# EAGLE design parallel_jtag_programmer_smd (EAGLE 7.6.0)
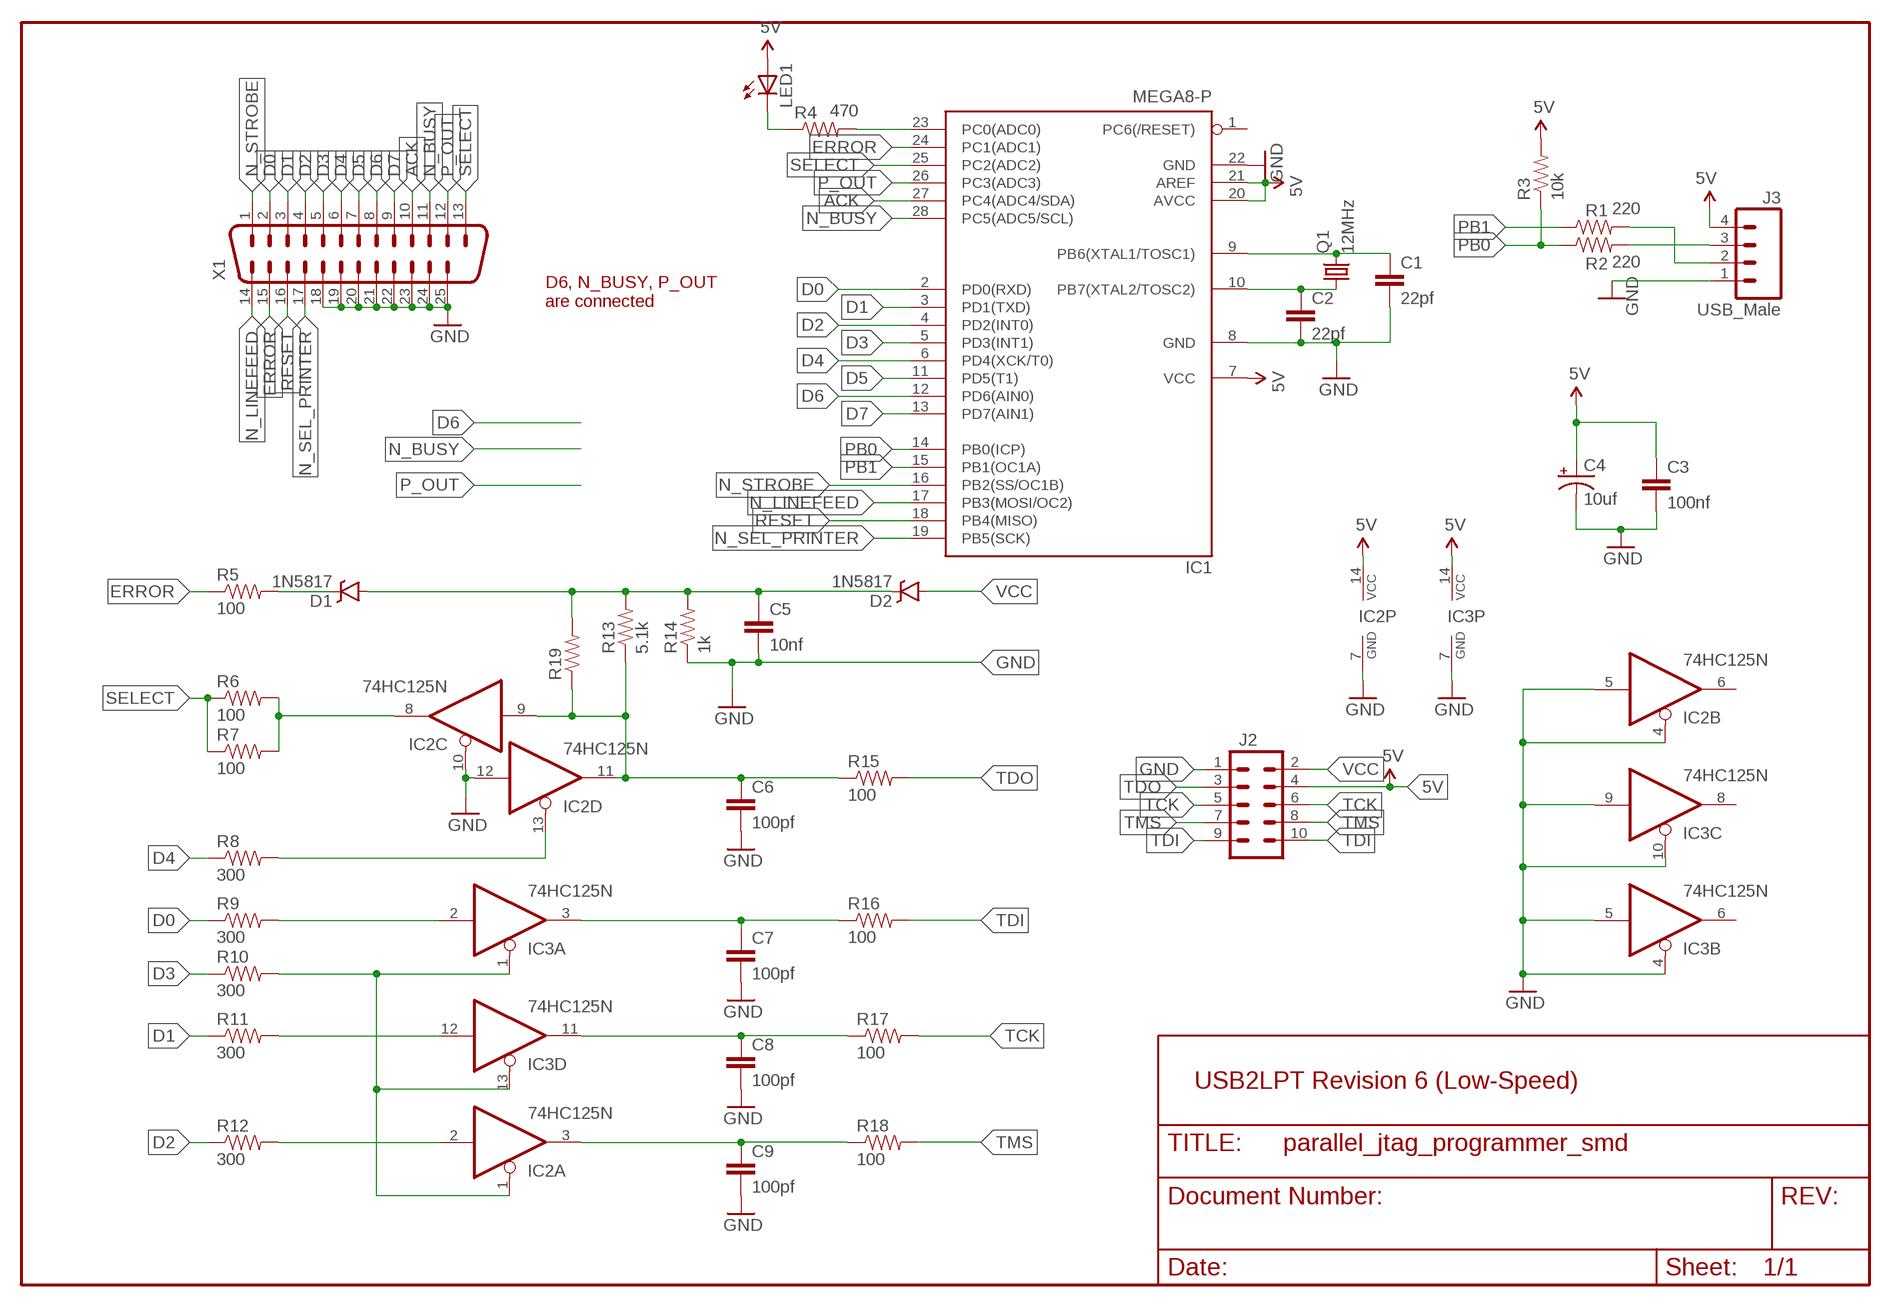
[diagram p0: schematic, sheet 1]

## Parts
C1  22pf  CAPPTH  [CAP-PTH-SMALL]
C2  22pf  CAPPTH  [CAP-PTH-SMALL]
C3  100nf  CAP1206  [1206]
C4  10uf  CAP_POL1206  [EIA3216]
C5  10nf  CAP1206  [1206]
C6  100pf  CAP1206  [1206]
C7  100pf  CAP1206  [1206]
C8  100pf  CAP1206  [1206]
C9  100pf  CAP1206  [1206]
D1  1N5817  DIODE-SCHOTTKY-B340A  [SMA-DIODE]
D2  1N5817  DIODE-SCHOTTKY-B340A  [SMA-DIODE]
IC1  MEGA8-P  [DIL28-3]
IC2  74HC125N  [DIL14]
IC3  74HC125N  [DIL14]
J2  M05X2SHD  [2X5-SHROUDED]
J3  USB_Male  M04PTH  [1X04]
LED1  LED3MM  [LED3MM]
Q1  12MHz  CRYSTALHC49U-V  [HC49U-V]
R1  220  RESISTOR1206  [1206]
R2  220  RESISTOR1206  [1206]
R3  10k  RESISTOR1206  [1206]
R4  470  RESISTOR1206  [1206]
R5  100  RESISTOR1206  [1206]
R6  100  RESISTOR1206  [1206]
R7  100  RESISTOR1206  [1206]
R8  300  RESISTOR1206  [1206]
R9  300  RESISTOR1206  [1206]
R10  300  RESISTOR1206  [1206]
R11  300  RESISTOR1206  [1206]
R12  300  RESISTOR1206  [1206]
R13  5.1k  RESISTOR1206  [1206]
R14  1k  RESISTOR1206  [1206]
R15  100  RESISTOR1206  [1206]
R16  100  RESISTOR1206  [1206]
R17  100  RESISTOR1206  [1206]
R18  100  RESISTOR1206  [1206]
R19  RESISTOR1206  [1206]
X1  DB25D  [M25D]

## Nets
5V: C3.1 C4.A(+) IC1.7(VCC) IC1.20(AVCC) IC1.21(AREF) IC2.14(P:VCC) IC3.14(P:VCC) J2.4 J3.4 LED1.A R3.2
ACK: IC1.27(PC4(ADC4/SDA)) X1.10
D0: IC1.2(PD0(RXD)) R9.1 X1.2
D1: IC1.3(PD1(TXD)) R11.1 X1.3
D2: IC1.4(PD2(INT0)) R12.1 X1.4
D3: IC1.5(PD3(INT1)) R10.1 X1.5
D4: IC1.6(PD4(XCK/T0)) R8.1 X1.6
D5: IC1.11(PD5(T1)) X1.7
D6: IC1.12(PD6(AIN0)) X1.8
D7: IC1.13(PD7(AIN1)) X1.9
ERROR: IC1.24(PC1(ADC1)) R5.1 X1.15
GND: C1.2 C2.2 C3.2 C4.C(-) C5.2 C6.2 C7.2 C8.2 C9.2 IC1.8(GND) IC1.22(GND) IC2.4(B:OE) IC2.5(B:I) IC2.7(P:GND) IC2.10(C:OE) IC2.12(D:I) IC3.4(B:OE) IC3.5(B:I) IC3.7(P:GND) IC3.9(C:I) IC3.10(C:OE) J2.1 J3.1 R14.1 X1.18 X1.19 X1.20 X1.21 X1.22 X1.23 X1.24 X1.25
N$1: LED1.K(C) R4.1
N$2: IC1.23(PC0(ADC0)) R4.2
N$3: C5.1 D1.A D2.C R13.2 R14.2 R19.2
N$4: C2.1 IC1.10(PB7(XTAL2/TOSC2)) Q1.1
N$5: C1.1 IC1.9(PB6(XTAL1/TOSC1)) Q1.2
N$7: J3.3 R2.2
N$9: C6.1 IC2.9(C:I) IC2.11(D:O) R13.1 R15.1 R19.1
N$10: IC2.13(D:OE) R8.2
N$11: IC2.8(C:O) R6.2 R7.2
N$12: J3.2 R1.2
N$13: IC3.2(A:I) R9.2
N$14: IC2.1(A:OE) IC3.1(A:OE) IC3.13(D:OE) R10.2
N$15: D1.C R5.2
N$16: C7.1 IC3.3(A:O) R16.1
N$18: C8.1 IC3.11(D:O) R17.1
N$19: IC3.12(D:I) R11.2
N$20: IC2.2(A:I) R12.2
N$23: C9.1 IC2.3(A:O) R18.1
N_BUSY: IC1.28(PC5(ADC5/SCL)) X1.11
N_LINEFEED: IC1.17(PB3(MOSI/OC2)) X1.14
N_SEL_PRINTER: IC1.19(PB5(SCK)) X1.17
N_STROBE: IC1.16(PB2(SS/OC1B)) X1.1
P_OUT: IC1.26(PC3(ADC3)) X1.12
PB0: IC1.14(PB0(ICP)) R2.1 R3.1
PB1: IC1.15(PB1(OC1A)) R1.1
RESET: IC1.18(PB4(MISO)) X1.16
SELECT: IC1.25(PC2(ADC2)) R6.1 R7.1 X1.13
TCK: J2.5 J2.6 R17.2
TDI: J2.9 J2.10 R16.2
TDO: J2.3 R15.2
TMS: J2.7 J2.8 R18.2
VCC: D2.A J2.2
Unconnected: IC1.1(PC6(/RESET)) IC2.6(B:O) IC3.6(B:O) IC3.8(C:O)

## Notes on the sheet
- D6, N_BUSY, P_OUT
  are connected
- USB2LPT Revision 6 (Low-Speed)

## Library data of the parts
C1-C3 C5-C9 = SparkFun-Passives:CAP: Capacitor Standard 0603 ceramic capacitor, and 0.1" leaded capacitor.
C4 = SparkFun-Passives1:CAP_POL: Capacitor Polarized These are standard SMD and PTH capacitors. Normally 10uF, 47uF, and 100uF in electrolytic and tantalum varieties. Always verify the external diameter of the through hole cap, it varies with capacity, voltage, and manufacturer. The EIA devices should be standard.
D1 D2 = SparkFun-DiscreteSemi:DIODE-SCHOTTKY: Schottky diodes in SFE's production catalog BAT20J 1A 23V 0.62Vf RB751 120mA 40V 0.37Vf PMEG4005EJ 0.5A 40V 0.42Vf MBRA140 1A 40V 0.5Vf B340A 3A 40V SMA; PROD_ID: DIO-09886; VALUE: B340A
IC1 = atmel:MEGA8-P: MICROCONTROLLER 8 Kbytes FLASH, 1 kbytes SRAM, 512 bytes EEPROM, USART, 4-channel 10 bit ADC, 2-channel 8 bit ADC Pin compatible with Atmega48, ATMega88, ATMega168 Source: avr.lbr; OC_FARNELL: unknown; OC_NEWARK: unknown
IC2 IC3 = 74xx-eu:74*125: Quad bus BUFFER, 3-state
J2 = SparkFun-Connectors:M05X2: Header 5x2 Standard 10-pin dual row 0.1" header. Commonly used with AVR-ISP. Use with Spark Fun Electronics SKU: PRT-00778
J3 = SparkFun-Connectors:M04: Header 4 Standard 4-pin 0.1" header. Use with straight break away headers (SKU : PRT-00116), right angle break away headers (PRT-00553), swiss pins (PRT-00743), machine pins (PRT-00117), and female headers (PRT-00115). Molex polarized connector foot print use with SKU : PRT-08231 with associated crimp pins and housings. 1MM SMD Version SKU: PRT-10208; PROD_ID: CONN-09696
LED1 = adafruit:LED: LED OSRAM: - CHIPLED LG R971, LG N971, LY N971, LG Q971, LY Q971, LO R971, LY R971 LH N974, LH R974 LS Q976, LO Q976, LY Q976 LO Q996 - Hyper CHIPLED LW Q18S LB Q993, LB Q99A, LB R99A - SideLED LS A670, LO A670, LY A670, LG A670, LP A670 LB A673, LV A673, LT A673, LW A673 LH A674 LY A675 LS A676, LA A676, LO A676, LY A676, LW A676 LS A679, LY A679, LG A679 - Hyper Micro SIDELED® LS Y876, LA Y876, LO Y876, LY Y876 LT Y87S - SmartLED LW L88C, LW L88S LB L89C, LB L89S, LG L890 LS L89K, LO L89K, LY L89K LS L896, LA L896, LO L896, LY L896 - TOPLED LS T670, LO T670, LY T670, LG T670, LP T670 LSG T670, LSP T670, LSY T670, LOP T670, LYG T670 LG T671, LOG T671, LSG T671 LB T673, LV T673, LT T673, LW T673 LH T674 LS T676, LA T676, LO T676, LY T676, LB T676, LH T676, LSB T676, LW T676 LB T67C, LV T67C, LT T67C, LS T67K, LO T67K, LY T67K, LW E67C LS E67B, LA E67B, LO E67B, LY E67B, LB E67C, LV E67C, LT E67C LW T67C LS T679, LY T679, LG T679 LS T770, LO T770, LY T770, LG T770, LP T770 LB T773, LV T773, LT T773, LW T773 LH T774 LS E675, LA E675, LY E675, LS T675 LS T776, LA T776, LO T776, LY T776, LB T776 LHGB T686 LT T68C, LB T68C - Hyper Mini TOPLED® LB M676 - Mini TOPLED Santana® LG M470 LS M47K, LO M47K, LY M47K Source: http://www.osram.convergy.de/
Q1 = crystal:CRYSTAL: CRYSTAL; OC_FARNELL: 1666969; OC_NEWARK: unknown
R1-R19 = SparkFun-Passives:RESISTOR: Resistor Basic schematic elements and footprints for 0603, 1206, and PTH resistors.
X1 = SparkFun-Connectors:DB25: Various DB25 connectors

## Net classes
0 default: width 0.4 mm, drill 0.8 mm, clearance 0.5 mm

## Board
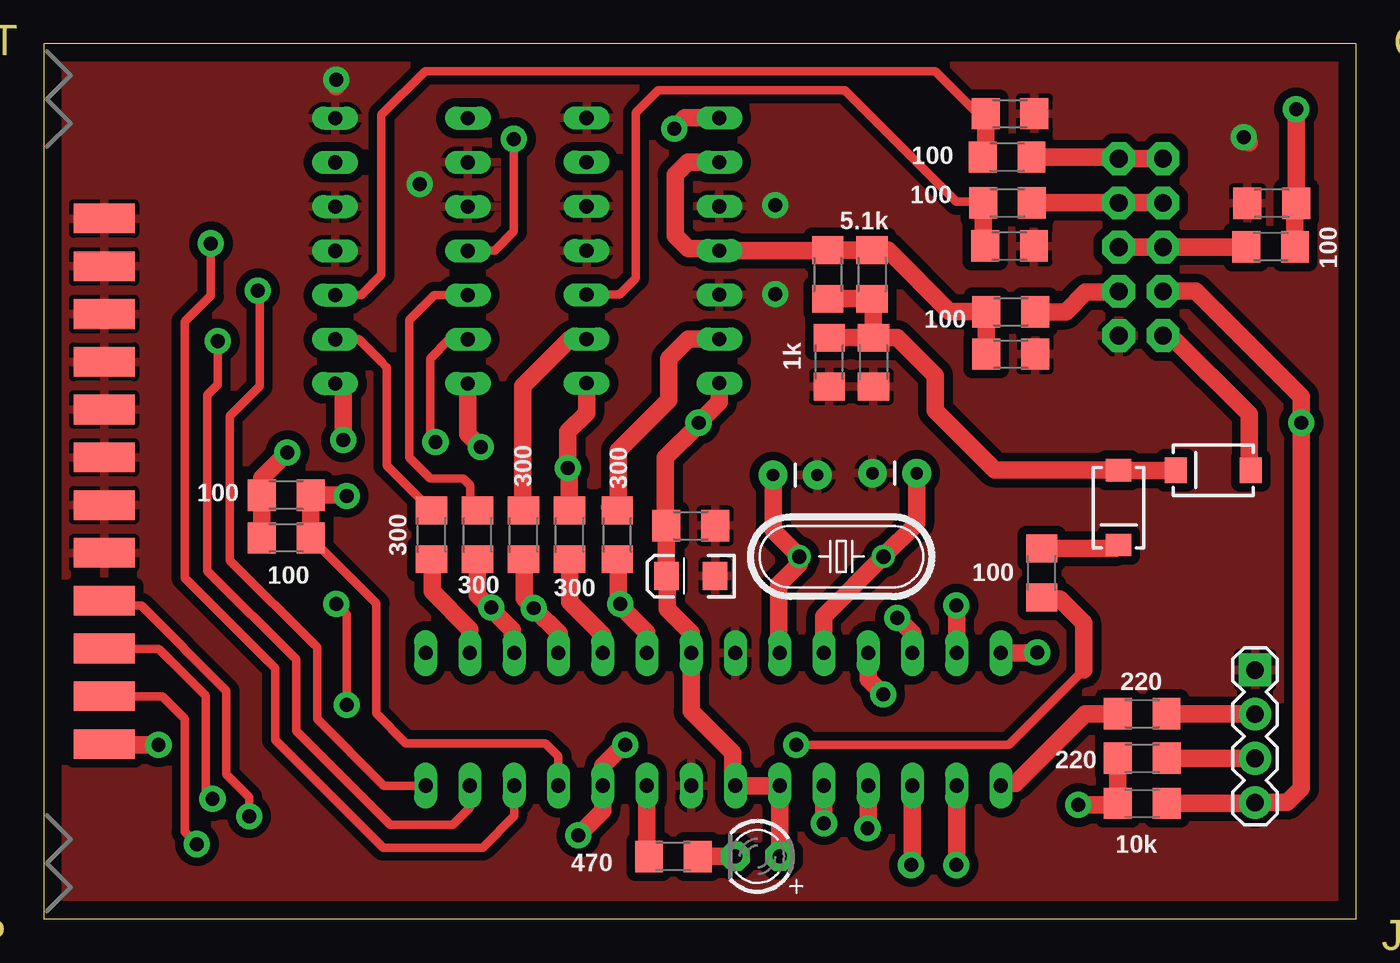
[diagram p1: board, top side]
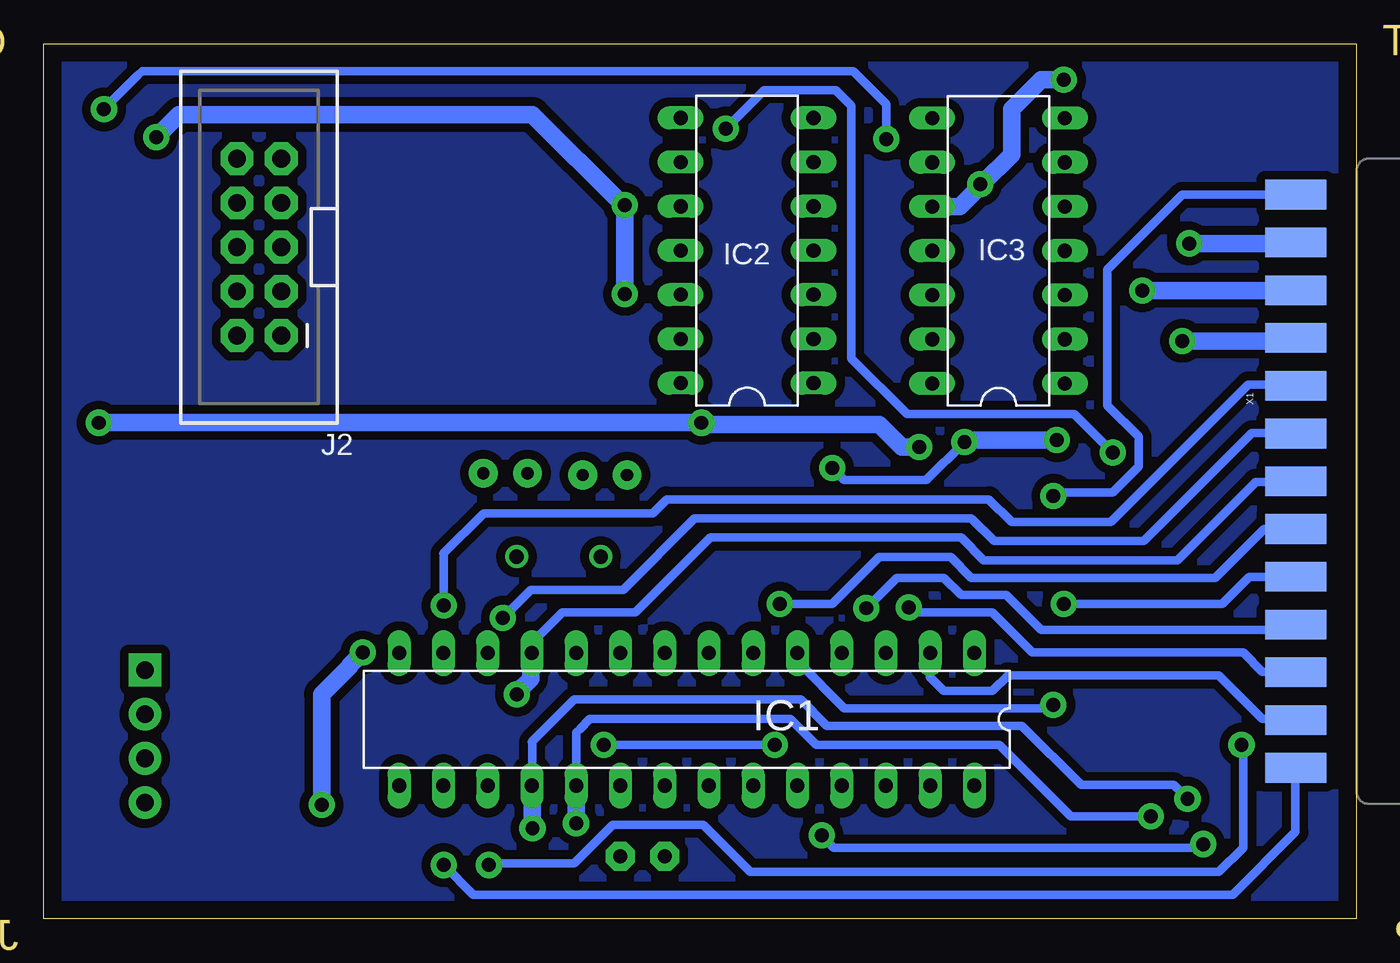
[diagram p2: board, bottom side, seen from below]

Size 75.37 x 50.28 mm. Coordinates in mm from the lower left corner, seen from the top.
Outline: 0,0 75.37,0 75.37,50.28 0,50.28 0,0
Copper layers (1*16): Top 0.035mm / dielectric 1.5mm / Bottom 0.035mm
Design rules "default": minimum track width 10mil, minimum drill 24mil, track to track 8mil, track to pad 8mil, pad to pad 8mil, via to via 8mil, smd to smd 8mil, copper to edge 40mil, drill to drill 8mil, minimum pad ring 10mil, minimum via ring 8mil, stop-mask expansion 4mil, vias tented up to drill 0mil, thermal gap 10mil

### Footprints (pad centres in the part's own frame; a part is rotated, then mirrored left to right if it is on the bottom)
CAP-PTH-SMALL = drill 0.7 pad 1.651: 1 0,0; 2 2.54,0
1206 = smd 1.6 x 1.8: 1 -1.4,0; 2 1.4,0
EIA3216 = smd 1.4 x 1.6: A 1.4,0; C -1.4,0
SMA-DIODE = smd 1.27 x 1.47: A -2.15,0; C 2.15,0
DIL28-3 = drill 0.813 long: 1 -16.51,-3.81; 2 -13.97,-3.81; 3 -11.43,-3.81; 4 -8.89,-3.81; 5 -6.35,-3.81; 6 -3.81,-3.81; 7 -1.27,-3.81; 8 1.27,-3.81; 9 3.81,-3.81; 10 6.35,-3.81; 11 8.89,-3.81; 12 11.43,-3.81; 13 13.97,-3.81; 14 16.51,-3.81; 15 16.51,3.81; 16 13.97,3.81; 17 11.43,3.81; 18 8.89,3.81; 19 6.35,3.81; 20 3.81,3.81; 21 1.27,3.81; 22 -1.27,3.81; 23 -3.81,3.81; 24 -6.35,3.81; 25 -8.89,3.81; 26 -11.43,3.81; 27 -13.97,3.81; 28 -16.51,3.81
DIL14 = drill 0.813 long: 1 -7.62,-3.81; 2 -5.08,-3.81; 3 -2.54,-3.81; 4 0,-3.81; 5 2.54,-3.81; 6 5.08,-3.81; 7 7.62,-3.81; 8 7.62,3.81; 9 5.08,3.81; 10 2.54,3.81; 11 0,3.81; 12 -2.54,3.81; 13 -5.08,3.81; 14 -7.62,3.81
2X5-SHROUDED = drill 1.016 pad 1.88 octagon: 1 -1.27,5.08; 2 1.27,5.08; 3 -1.27,2.54; 4 1.27,2.54; 5 -1.27,0; 6 1.27,0; 7 -1.27,-2.54; 8 1.27,-2.54; 9 -1.27,-5.08; 10 1.27,-5.08
1X04 = drill 1.016 pad 1.88 square: 1 0,0 | drill 1.016 pad 1.88: 2 2.54,0; 3 5.08,0; 4 7.62,0
LED3MM = drill 0.813 pad 1.676 octagon: A -1.27,0; K 1.27,0
HC49U-V = drill 0.813: 1 -2.413,0; 2 2.413,0
M25D = smd 1.7 x 3.5: 1 16.459,-6.045; 2 13.716,-6.045; 3 10.973,-6.045; 4 8.23,-6.045; 5 5.486,-6.045; 6 2.743,-6.045; 7 0,-6.045; 8 -2.743,-6.045; 9 -5.486,-6.045; 10 -8.23,-6.045; 11 -10.973,-6.045; 12 -13.716,-6.045; 13 -16.459,-6.045 | smd 1.7 x 3.5 bottom: 14 15.088,-6.045; 15 12.344,-6.045; 16 9.601,-6.045; 17 6.858,-6.045; 18 4.115,-6.045; 19 1.372,-6.045; 20 -1.372,-6.045; 21 -4.115,-6.045; 22 -6.858,-6.045; 23 -9.601,-6.045; 24 -12.344,-6.045; 25 -15.088,-6.045

### Placement (x,y rotation side)
C1  41.88,25.5 0 top
C2  50.12,25.6 180 top
C3  37.15,22.59 0 top
C4  37.15,19.69 180 top
C5  47.64,31.98 270 top
C6  55.52,32.44 0 top
C7  55.48,46.25 0 top
C8  70.51,41.1 180 top
C9  55.45,38.66 0 top
D1  61.72,23.62 270 top
D2  67.14,25.78 180 top
IC1  38.45,11.47 180 bottom
IC2  34.98,38.39 90 bottom
IC3  20.55,38.38 90 bottom
J2  63,38.59 180 bottom
J3  69.55,14.3 270 top
LED1  40.99,3.59 180 top
Q1  45.8,20.81 180 top
R1  63.06,11.79 0 top
R2  63.07,9.23 0 top
R3  63.07,6.64 0 top
R4  36.16,3.59 180 top
R5  57.3,19.87 90 top
R6  13.93,24.35 180 top
R7  13.93,21.88 180 top
R8  32.94,22.07 90 top
R9  22.28,22.07 90 top
R10  30.2,22.07 90 top
R11  24.92,22.07 90 top
R12  27.56,22.07 90 top
R13  47.56,37.02 270 top
R14  45.11,31.98 90 top
R15  55.52,34.87 0 top
R16  55.31,43.76 0 top
R17  70.44,38.61 180 top
R18  55.34,41.13 0 top
R19  45.02,37.02 270 top
X1  -2.56,25.14 270 bottom

### Tracks (layer width: path | path; a pad name or v marks a point on that pad's centre or on a via)
5V  (via drill 0.8 pad 1.5)
  Top 1: LED1.A IC1.20 IC1.21 39.55,7.82 39.55,9.55 37.18,11.92 IC1.7 37.18,16.42 35.8,17.8 35.8,19.65 C4.A C3.1 35.7,22.64 35.7,26.5 37.6,28.4 v37.6,28.5 38.79,29.69 IC2.14 | IC3.14 24.36,27.84 v25.1,27.1 | R3.2 69.51,6.64 J3.4 69.57,6.7 71.4,6.7 72.2,7.5 v72.2,28.5 72.2,28.6 72.2,30 66.15,36.05 J2.4
  Bottom 1: v37.6,28.5 v72.2,28.5 | v25.1,27.1 26.1,27.1 27.4,28.4 37.5,28.4 v37.6,28.5 | 37.5,28.6 v37.6,28.5
ACK  (via drill 0.8 pad 1.5)
  Top 0.5: IC1.27 24.48,6.38 23.5,5.4 19.9,5.4 14.5,10.8 14.5,14.9 9.4,20 9.4,30.1 10,30.7 v10,33.2
  Bottom 0.5: 3.65,33.2 X1.10
  Bottom 1: 3.65,33.2 v10,33.2
D0
  Top 1: IC1.2 24.48,16.62 22.3,18.8 22.3,20.64 R9.1
  Bottom 0.5: IC1.2 24.5,15.25 24.5,13.9 23.7,13.1 20.9,13.1 20,14 7.9,14 5.4,11.5 3.56,11.5 X1.2
D1  (via drill 0.8 pad 1.5)
  Top 1: R11.1 24.9,20.65 24.9,18.6 25.6,17.9 v25.7,17.9 25.7,17.8 26.9,16.6 26.9,15.39 IC1.3
  Bottom 0.5: v25.7,17.9 25.4,17.6 20.9,17.6 18.6,15.3 6.5,15.3 5.4,14.2 3.51,14.2 X1.3
D2  (via drill 0.8 pad 1.5)
  Top 1: R12.1 27.6,20.62 27.6,18.4 v28.15,17.85 29.6,16.4 29.6,15.32 IC1.4
  Bottom 0.5: 3.59,16.8 X1.4 3.79,16.6 18.1,16.6 20.1,18.6 22.7,18.6 23.7,19.6 26.4,19.6 v28.15,17.85
D3  (via drill 0.8 pad 1.5)
  Top 0.5: v16.8,18.1 17.4,17.5 v17.4,12.3
  Top 1: IC1.5 32.1,16.3 30.2,18.2 R10.1
  Bottom 0.5: 32.1,16.3 IC1.5 32,15.18 32,14.7 29.4,12.1 17.7,12.1 17.5,12.3 v17.4,12.3 | X1.5 6.14,19.66 7.7,18.1 v16.8,18.1
D4  (via drill 0.8 pad 1.5)
  Top 0.5: v33.1,18.1 33.3,18.1 33,18.4
  Top 1: IC1.6 34.64,16.46 33,18.1 33,18.4 33,20.6 R8.1
  Bottom 0.5: X1.6 5.3,22.4 8.1,19.6 22.1,19.6 23.3,20.8 27.4,20.8 30.1,18.1 v33.1,18.1
D5  (via drill 0.8 pad 1.5)
  Top 1: IC1.11 47.34,13.76 v48.2,12.9
  Bottom 0.5: X1.7 3.52,25.1 5.78,25.1 10.17,20.72 | 10.3,20.6 10.17,20.72 | 10.17,20.72 10.28,20.6 21.4,20.6 22.7,21.9 37.1,21.9 41.4,17.6 45.6,17.6 47.34,15.86 IC1.11
  Bottom 1: v48.2,12.9 48.2,13 47.4,13.8 47.4,15.21 IC1.11
D6  (via drill 0.8 pad 1.5)
  Top 1: v49,17.3 49.9,16.4 49.9,15.3 IC1.12
  Bottom 0.5: X1.8 3.5,27.9 6,27.9 12.2,21.7 20.8,21.7 22.1,23 38,23 42.1,18.9 47.4,18.9 v49,17.3
D7  (via drill 0.8 pad 1.5)
  Top 1: IC1.13 52.42,17.98 v52.4,18
  Bottom 0.5: X1.9 3.55,30.7 6.2,30.7 14.1,22.8 19.8,22.8 21.1,24.1 39.6,24.1 40.4,23.3 50.1,23.3 52.42,20.98 52.4,20.97 v52.4,18
ERROR  (via drill 0.8 pad 1.5)
  Top 0.5: 59.7,14.3 55.4,10 v43.2,10 | X1.15 6.8,12.8 8.1,11.5 8.1,5 v8.8,4.3
  Top 1: R5.1 57.4,18.37 58.33,18.37 59.7,17 59.7,14.3 | v33.4,10 33.3,10 32.1,8.8 IC1.24 | IC1.24 | IC1.24 32.1,6.2 v30.7,4.8
  Bottom 0.5: v33.4,10 v43.2,10 | v8.8,4.3 8.9,4.3 9.1,4.1 30,4.1 v30.7,4.8
GND  (via drill 0.8 pad 1.5)
  Top 0.5: IC3.10 23.78,40.92 | 41.93,40.93 v42,41
  Top 1: v42,35.9 42,35.8 | v16.8,48.2 16.8,47.8 | v68.9,44.9 69.2,44.6
  Bottom 1: v42,35.9 v42,41 42.1,41 47.3,46.2 67.6,46.2 v68.9,44.9 | v16.8,48.2 18.1,48.2 19.8,46.5 19.8,43.9 21.5,42.2 v21.6,42.2 | IC3.10 22.78,40.92 21.6,42.1
  pour Top: 0,-0.25 0,50.25 75.75,50.25 75.75,-0.25
N$1
  Top 1: R4.1 LED1.K
N$2
  Top 1: IC1.23 34.64,3.71 R4.2
N$3
  Top 1: R19.2 R13.2 47.64,35.53 C5.1 | R14.2 C5.1 | C5.1 49.02,33.38 51.2,31.2 51.2,29.2 54.6,25.8 61.69,25.8 D1.A D2.C
N$4
  Top 1: C2.1 50.12,22.72 Q1.1 44.8,17.39 IC1.10
N$5
  Top 1: C1.1 41.88,22.32 Q1.2 43.39,20.39 42.2,19.2 42.2,15.33 IC1.9
N$6
  pour Bottom: 0,0 -0.3,0 -0.3,50.5 75.7,50.5 75.7,-0.1 0,-0.1
N$7
  Top 1: R2.2 J3.3
N$9
  Top 1: IC2.9 36.97,43.47 36.25,42.75 36.25,39.25 37,38.5 38.68,38.5 IC2.11 44.99,38.39 R19.1 R13.1 48.48,38.42 52,34.9 54.09,34.9 R15.1 C6.1
N$10
  Top 1: IC2.13 37.01,33.31 35.9,32.2 35.9,29.8 33,26.9 33,23.53 R8.2 32.5,23.63
N$11  (via drill 0.8 pad 1.5)
  Top 1: R7.2 R6.2 12.53,25.33 v14,26.8 | IC2.8 36.81,46.01 v36.2,45.4
  Bottom 0.5: 36.2,45.6 v36.2,45.4 34,47.6 29.9,47.6 29,46.7 29,32.2 25.8,29 16.2,29 v14,26.8
N$12
  Top 1: R1.2 69.52,11.79 J3.2
N$13
  Top 0.5: IC3.2 18.1,33.3 19.45,31.95 19.6,31.8 19.7,31.7 19.7,26.04 R9.2
N$14  (via drill 0.8 pad 1.5)
  Top 0.5: v30.1,25.9 30.07,25.9 30.17,25.8 | IC3.13 23.3,33.3 22.2,32.2 22.2,27.7 v22.5,27.4
  Top 1: 30.17,23.84 R10.2 30.17,23.49 30.17,25.8 | IC2.1 31.17,29.07 30.1,28 v30.1,25.9 | IC3.1 17.2,30.3 v17.2,27.5
  Bottom 0.5: 22.2,27.5 v22.5,27.4 24.7,25.2 29.4,25.2 v30.1,25.9
  Bottom 1: v17.2,27.5 22.4,27.5 v22.5,27.4
N$15
  Top 1: R5.2 61.52,21.27 D1.C
N$16
  Top 0.5: IC3.3 18.24,35.84 19.4,37 19.4,46.2 21.9,48.7 51.18,48.7 54.08,45.8
  Top 1: C7.1 54.08,45.8 54.08,44.02 R16.1
N$18  (via drill 0.8 pad 1.5)
  Top 0.5: IC3.11 25.28,38.38 25.3,38.4 25.9,38.4 27,39.5 v27,44.8
  Top 1: R17.1 71.84,41.03 C8.1 v71.9,46.5
  Bottom 0.5: v71.9,46.5 69.95,48.45 69.7,48.7 28.9,48.7 27,46.8 v27,44.8
N$19
  Top 0.5: IC3.12 22.44,35.84 21,34.4 21,26.5 22.2,25.3 24.1,25.3 24.5,24.9 24.5,23.88 R11.2 24.6,23.58 24.6,24
  Top 1: 24.75,23.5 R11.2
N$20
  Top 0.5: 27.4,23.61 R12.2 27.4,23.62
  Top 1: IC2.2 30.21,33.31 27.5,30.6 27.5,23.52 R12.2
N$23
  Top 0.5: IC2.3 33.05,35.85 34,36.8 34,46.3 35.3,47.6 46,47.6 52.4,41.2 53.87,41.2 R18.1
  Top 1: R18.1 53.94,38.77 C9.1
N_BUSY  (via drill 0.8 pad 1.5)
  Top 0.5: IC1.28 19.54,7.66 15.7,11.5 15.7,15.6 10.7,20.6 10.7,28.9 12.4,30.6 12.4,36 v12.3,36.1
  Bottom 0.5: 3.5,36.1 X1.11
  Bottom 1: 3.5,36.1 v12.3,36.1
N_LINEFEED  (via drill 0.8 pad 1.5)
  Top 0.5: 3.54,10 X1.14
  Top 1: 3.54,10 v6.6,10 | IC1.17 49.88,3.18 v49.8,3.1
  Bottom 0.5: v6.6,10 6.5,9.9 6.5,4.1 7.9,2.7 34.8,2.7 37.5,5.4 42.7,5.4 44.9,3.2 49.7,3.2 v49.8,3.1
N_SEL_PRINTER  (via drill 0.8 pad 1.5)
  Top 0.5: X1.17 3.5,18.3 4.9,18.3 4.9,18 5.6,18 10.5,13.1 10.5,8.3 11.8,7 v11.8,5.9
  Top 1: IC1.19 v44.8,5.5
  Bottom 0.5: v11.8,5.9 16.4,5.9 20.5,10 31,10 32.5,11.5 44,11.5 44.6,10.9 44.8,10.7 44.8,7.6
  Bottom 1: v44.8,5.5 44.8,7.6
N_STROBE  (via drill 0.8 pad 1.5)
  Top 1: IC1.16 52.42,3.12 v52.4,3.1
  Bottom 0.5: X1.1 3.5,8.66 3.5,5 7.1,1.4 50.7,1.4 v52.4,3.1
P_OUT  (via drill 0.8 pad 1.5)
  Top 0.5: 27.02,6.62 IC1.26 27.02,5.92 25.2,4.1 19.5,4.1 13.3,10.3 13.3,14.4 8.1,19.6 8.1,34.3 9.6,35.8 v9.6,38.8
  Bottom 0.5: 3.54,38.8 X1.12
  Bottom 1: 3.54,38.8 v9.6,38.8
PB0  (via drill 0.8 pad 1.5)
  Top 1: R2.1 R3.1 61.58,6.55 v59.4,6.55 | IC1.14 56.78,15.28 56.8,15.3 v57.05,15.3
  Bottom 1: v57.05,15.3 57.8,14.55 57.8,14.5 59.4,12.9 v59.4,6.55
PB1
  Top 1: R1.1 59.79,11.79 55.8,7.8 55.1,7.8 IC1.15
RESET  (via drill 0.8 pad 1.5)
  Top 0.5: X1.16 3.52,15.5 6.6,15.5 9.3,12.8 9.3,7.3 v9.7,6.9
  Top 1: IC1.18 47.34,5.24 v47.3,5.2
  Bottom 0.5: 47.3,10.2 47.34,10.16 | v9.7,6.9 10.5,7.7 15.8,7.7 19.2,11.1 30.4,11.1 31.9,12.6 44.9,12.6 47.25,10.25 47.3,10.2 | 47.3,7.7 47.3,10.2
  Bottom 1: v47.3,5.2 47.3,7.7
SELECT  (via drill 0.8 pad 1.5)
  Top 0.5: IC1.25 29.56,9.34 28.8,10.1 20.8,10.1 19.1,11.8 19.1,18.12 R7.1
  Top 1: R7.1 R6.1 17.35,24.35 v17.4,24.3
  Bottom 0.5: X1.13 10,41.6 14.3,37.3 14.3,29.5 12.5,27.7 12.5,26 14,24.5 16.75,24.5 16.9,24.35 17.35,24.35 v17.4,24.3
TCK
  Top 1: J2.5 J2.6 69.02,38.59 R17.2
TDI
  Top 1: R16.2 61.64,43.76 J2.9 J2.10
TDO
  Top 1: R15.2 58.67,34.87 59.8,36 61.68,36 J2.3
TMS
  Top 1: R18.2 J2.7 J2.8
VCC
  Top 1: J2.2 64.69,33.51 69.2,29 69.2,25.87 D2.A

### Text on the board
Dimension: T | O | P | J